# EAGLE design RN487 dev board (EAGLE 9.4.2)
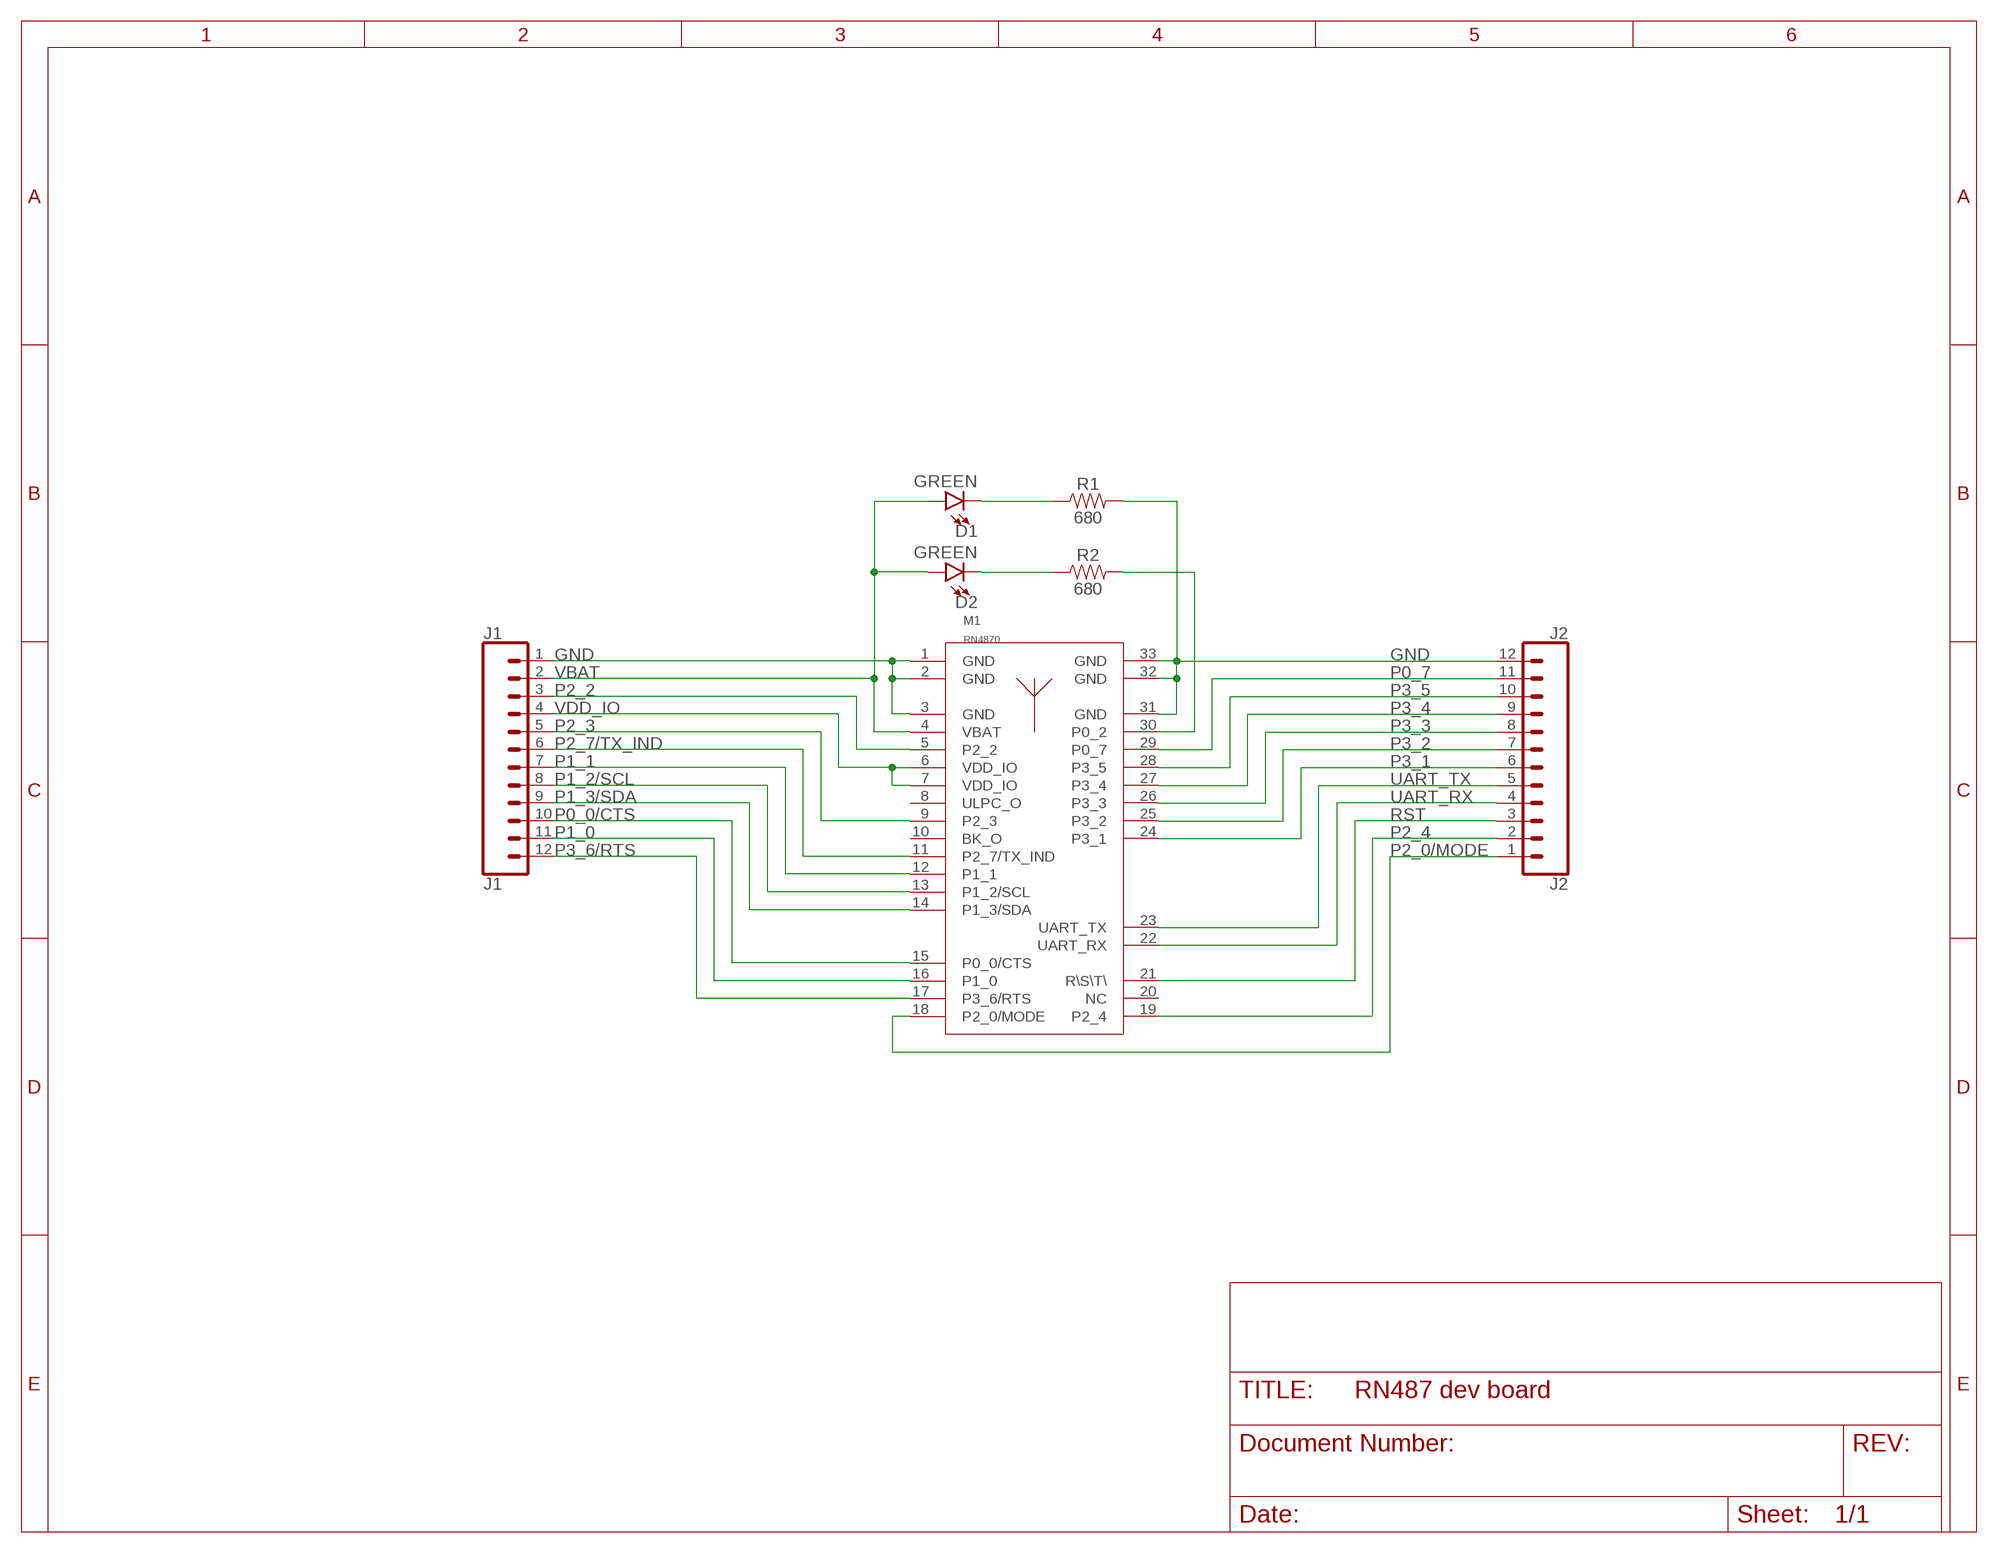
[diagram p0: schematic, sheet 1]

## Parts
D1  GREEN  LED-GREEN0603  [LED-0603]
D2  GREEN  LED-GREEN0603  [LED-0603]
J1  J1  CONN_12  [1X12]
J2  J2  CONN_12  [1X12]
M1  RN4870  [RN4870]
R1  680  680OHM-0603-1/10W-5%  [0603]
R2  680  680OHM-0603-1/10W-5%  [0603]

## Nets
GND: J1.1 J2.12 M1.1(GND) M1.2(GND) M1.3(GND) M1.31(GND) M1.32(GND) M1.33(GND) R1.2
N$1: D2.C R2.1
N$3: D1.C R1.1
N$17: M1.30(P0_2) R2.2
P0_0/CTS: J1.10 M1.15(P0_0/CTS)
P0_7: J2.11 M1.29(P0_7)
P1_0: J1.11 M1.16(P1_0)
P1_1: J1.7 M1.12(P1_1)
P1_2/SCL: J1.8 M1.13(P1_2/SCL)
P1_3/SDA: J1.9 M1.14(P1_3/SDA)
P2_0/MODE: J2.1 M1.18(P2_0/MODE)
P2_2: J1.3 M1.5(P2_2)
P2_3: J1.5 M1.9(P2_3)
P2_4: J2.2 M1.19(P2_4)
P2_7/TX_IND: J1.6 M1.11(P2_7/TX_IND)
P3_1: J2.6 M1.24(P3_1)
P3_2: J2.7 M1.25(P3_2)
P3_3: J2.8 M1.26(P3_3)
P3_4: J2.9 M1.27(P3_4)
P3_5: J2.10 M1.28(P3_5)
P3_6/RTS: J1.12 M1.17(P3_6/RTS)
RST: J2.3 M1.21(R\S\T\)
UART_RX: J2.4 M1.22(UART_RX)
UART_TX: J2.5 M1.23(UART_TX)
VBAT: D1.A D2.A J1.2 M1.4(VBAT)
VDD_IO: J1.4 M1.6(VDD_IO) M1.7(VDD_IO)
Unconnected: M1.8(ULPC_O) M1.10(BK_O) M1.20(NC)

## Library data of the parts
D1 D2 = SparkFun-LED:LED-GREEN: Green SMD LED Used in manufacturing of various products at SparkFun Packages: 0603 - SMD 0603 package [Product Link] <http://www.futureelectronics.com/en/technologies/semiconductors/optoelectronics/leds/Pages/9894312-LTST-C190GKT.aspx?CrossPart=HSMG-C190&IM=0> LilyPad 1206 - SMD1206 LilyPad package [Product Link] <http://www.futureelectronics.com/en/Technologies/Product.aspx?ProductID=IN150NGHARVATEKCORPORATION2049943&IM=0> 1206 - SMD1206 package [Product Link] <http://www.futureelectronics.com/en/technologies/semiconductors/optoelectronics/leds/Pages/8315665-LTST-C150KGKT.aspx?IM=0> 1206 Bottom Mount -SMD 1206 Bottom Mount [Product Link] <http://www.digikey.com/product-detail/en/lite-on-inc/LTST-C230KGKT/160-1456-1-ND/386854> SparkFun Products: Pro Mini 328 -5V <https://www.sparkfun.com/products/821> RedBoard <https://www.sparkfun.com/products/12757> MP3 Trigger <https://www.sparkfun.com/products/13720> Makey Makey <https://www.sparkfun.com/products/11076>; PROD_ID: DIO-00821
J1 J2 = SparkFun-Connectors:CONN_12: Multi connection point. Often used as Generic Header-pin footprint for 0.1 inch spaced/style header connections On any of the 0.1 inch spaced packages, you can populate with these: Break Away Headers - Straight <https://www.sparkfun.com/products/116> (PRT-00116) Break Away Male Headers - Right Angle <https://www.sparkfun.com/products/553> (PRT-00553) Female Headers <https://www.sparkfun.com/products/115> (PRT-00115) Break Away Headers - Machine Pin <https://www.sparkfun.com/products/117> (PRT-00117) Break Away Female Headers - Swiss Machine Pin <https://www.sparkfun.com/products/743> (PRT-00743) For SCREWTERMINALS and SPRING TERMINALS visit here: Screw Terimnals on SparkFun.com <https://www.sparkfun.com/search/results?term=Screw+Terminals> (5mm/3.5mm/2.54mm spacing) This device is also useful as a general connection point to wire up your design to another part of your project. Our various solder wires solder well into these plated through hole pads. Hook-Up Wire - Assortment (Stranded, 22 AWG) <https://www.sparkfun.com/products/11375> (PRT-11375) Hook-Up Wire - Assortment (Solid Core, 22 AWG) <https://www.sparkfun.com/products/11367> (PRT-11367) View the entire wire category on our website here <https://www.sparkfun.com/categories/141> Special notes: Molex polarized connector foot print use with SKU : PRT-08231 with associated crimp pins and housings. 1MM SMD Version SKU: PRT-10208 NOTES ON THE VARIANTS LOCK and LOCK_LONGPADS... This footprint was designed to help hold the alignment of a through-hole component (i.e. 6-pin header) while soldering it into place. You may notice that each hole has been shifted either up or down by 0.005 of an inch from it's more standard position (which is a perfectly straight line). This slight alteration caused the pins (the squares in the middle) to touch the edges of the holes. Because they are alternating, it causes a "brace" to hold the component in place. 0.005 has proven to be the perfect amount of "off-center" position when using our standard breakaway headers. Although looks a little odd when you look at the bare footprint, once you have a header in there, the alteration is very hard to notice. Also,if you push a header all the way into place, it is covered up entirely on the bottom side.
M1 = RN4870:RN4870
R1 R2 = SparkFun-Resistors:680OHM: 680Ω resistor A resistor is a passive two-terminal electrical component that implements electrical resistance as a circuit element. Resistors act to reduce current flow, and, at the same time, act to lower voltage levels within circuits. - Wikipedia; PROD_ID: RES-09333

## Board
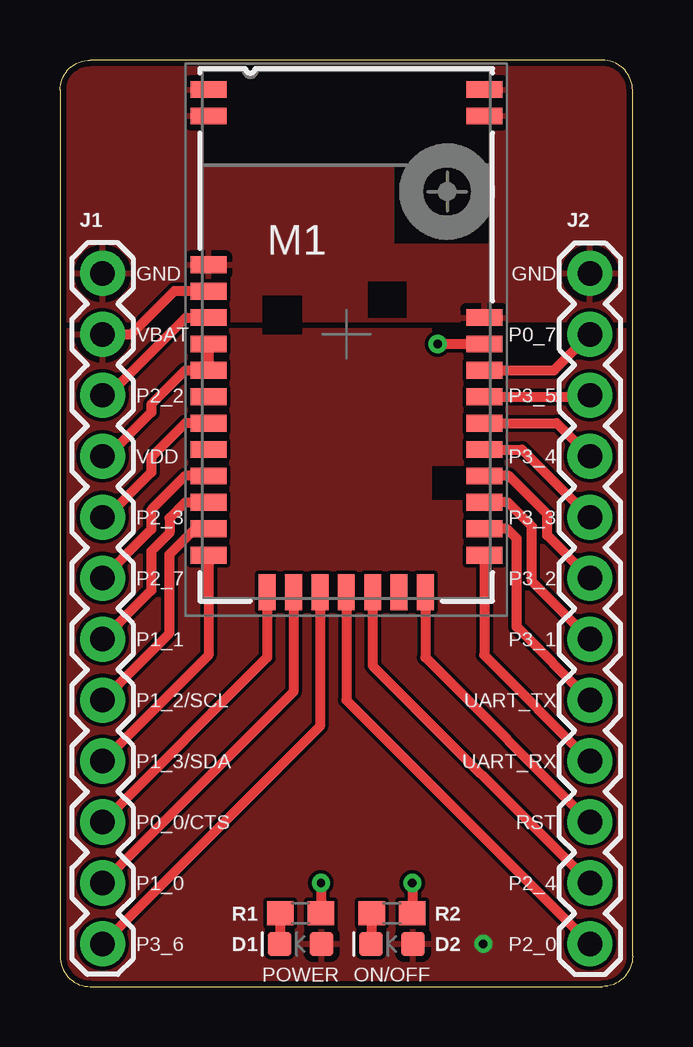
[diagram p1: board, top side]
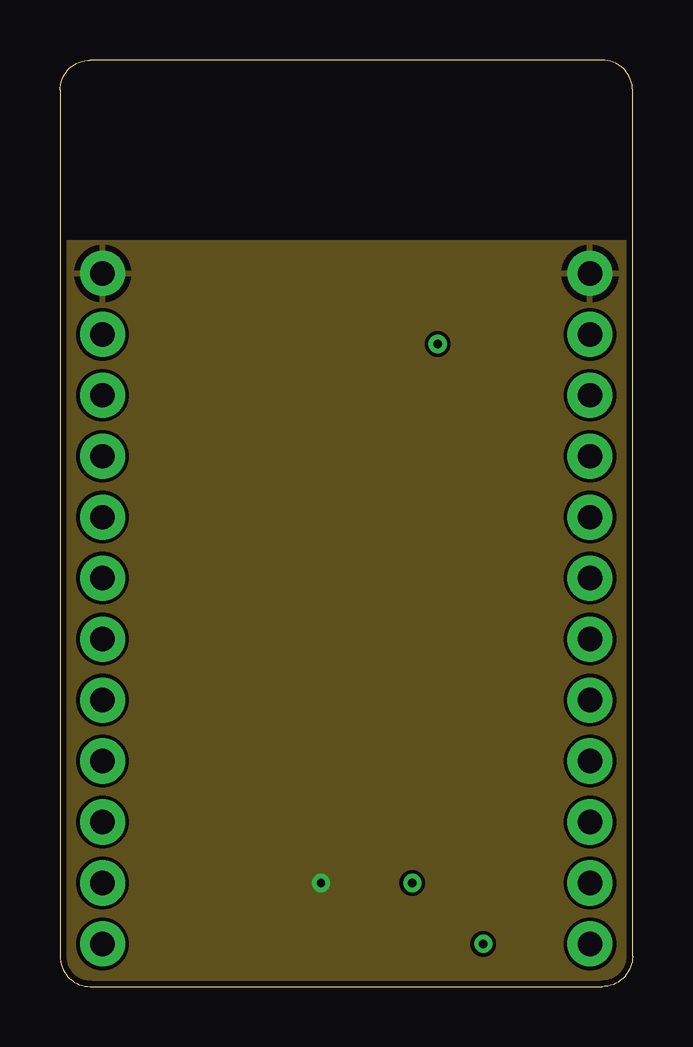
[diagram p2: board, inner layer Route2]
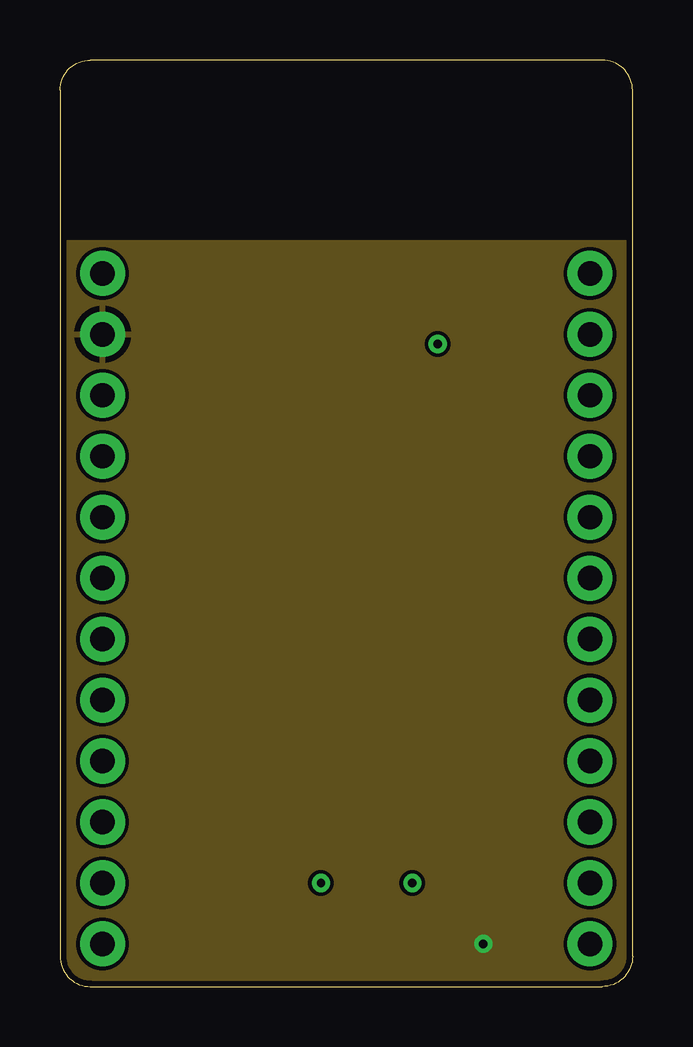
[diagram p3: board, inner layer Route15]
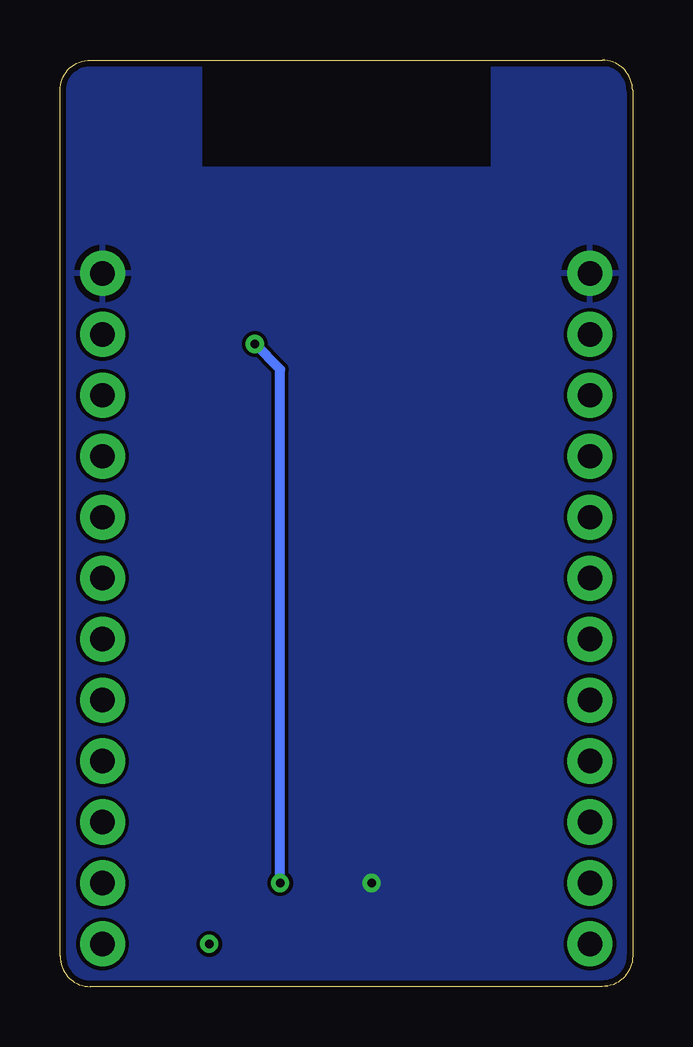
[diagram p4: board, bottom side, seen from below]

Size 23.88 x 38.61 mm. Coordinates in mm from the lower left corner, seen from the top.
Outline: 1.27,0 22.61,0 arc90 23.88,1.27 23.88,37.34 arc90 22.61,38.61 1.27,38.61 arc90 0,37.34 0,1.27 arc90 1.27,0
Copper layers (1+2*15+16): Top 0.0178mm / dielectric 12mil / Route2 0.0356mm / dielectric 28mil / Route15 0.0356mm / dielectric 12mil / Bottom 0.0178mm
Design rules "SSC-EAGLE-4Lyr_v1.0.0.3 *": minimum track width 6mil, minimum drill 8mil, track to track 6mil, track to pad 6mil, pad to pad 6mil, via to via 6mil, smd to smd 6mil, copper to edge 10mil, drill to drill 16mil, minimum pad ring 8mil, minimum via ring 8mil, stop-mask expansion 3mil, vias tented up to drill 0mil, thermal gap 10mil

### Footprints (pad centres in the part's own frame; a part is rotated, then mirrored left to right if it is on the bottom)
LED-0603 = smd 1 x 1: A -0.877,0; C 0.877,0
1X12 = drill 1.016 pad 1.88: 1 0,0; 2 2.54,0; 3 5.08,0; 4 7.62,0; 5 10.16,0; 6 12.7,0; 7 15.24,0; 8 17.78,0; 9 20.32,0; 10 22.86,0; 11 25.4,0; 12 27.94,0
RN4870 = smd 1.5 x 0.7: 1 -5.742,10.2; 2 -5.742,9.1; 3 -5.75,2.9; 4 -5.75,1.8; 5 -5.75,0.7; 6 -5.75,-0.4; 7 -5.75,-1.5; 8 -5.75,-2.6; 9 -5.75,-3.7; 10 -5.75,-4.8; 11 -5.75,-5.9; 12 -5.75,-7; 13 -5.75,-8.1; 14 -5.75,-9.2; 22 5.75,-9.2; 23 5.75,-8.1; 24 5.75,-7; 25 5.75,-5.9; 26 5.75,-4.8; 27 5.75,-3.7; 28 5.75,-2.6; 29 5.75,-1.5; 30 5.75,-0.4; 31 5.75,0.7; 32 5.75,9.1; 33 5.75,10.2 | smd 0.7 x 1.5: 15 -3.3,-10.75; 16 -2.2,-10.75; 17 -1.1,-10.75; 18 0,-10.75; 19 1.1,-10.75; 20 2.2,-10.75; 21 3.3,-10.75
0603 = smd 1.1 x 1: 1 -0.85,0; 2 0.85,0

### Placement (x,y rotation side)
D1  10.03,1.78 180 top
D2  13.84,1.78 180 top
J1  1.78,29.72 270 top
J2  22.1,1.78 90 top
M1  11.94,27.18 0 top
R1  10.03,3.05 0 top
R2  13.84,3.05 0 top

### Tracks (layer width: path | path; a pad name or v marks a point on that pad's centre or on a via)
GND  (via drill 0.35)
  Top 0.406: v10.88,4.32 R1.2
  pour Top: 0,27.81 23.88,27.81 23.88,38.61 0,38.61
  pour Bottom: 0,0 23.88,0 23.88,38.61 0,38.61
  pour Route2: 0,0 0,30.99 23.88,30.99 23.88,0
N$1
  Top 0.406: R2.1 12.99,1.8 D2.C
N$3
  Top 0.406: R1.1 9.18,1.8 D1.C
N$17  (via drill 0.35)
  Top 0.406: v14.69,4.32 R2.2 | v15.75,26.78 M1.30
  Bottom 0.406: v14.69,4.32 14.69,25.72 v15.75,26.78
P0_0/CTS
  Top 0.406: M1.15 8.64,13.72 J1.10
P0_7
  Top 0.406: M1.29 20.6,25.68 J2.11
P1_0
  Top 0.406: J1.11 9.74,12.28 M1.16
P1_1
  Top 0.406: J1.7 3.81,16.51 3.81,18.14 4.57,18.9 4.57,19.52 5.23,20.18 M1.12
P1_2/SCL
  Top 0.406: J1.8 4.57,14.73 4.57,18.01 5.64,19.08 M1.13
P1_3/SDA
  Top 0.406: M1.14 6.19,13.81 J1.9
P2_0/MODE
  Top 0.406: M1.18 11.94,11.94 J2.1
P2_2
  Top 0.406: J1.3 2,24.64 5.24,27.88 M1.5
P2_3
  Top 0.406: M1.9 5.23,23.48 3.81,22.06 3.81,21.43 1.94,19.56 J1.5
P2_4
  Top 0.406: M1.19 13.04,13.38 J2.2
P2_7/TX_IND
  Top 0.406: M1.11 5.22,21.28 3.81,19.86 3.81,19.05 J1.6
P3_1
  Top 0.406: J2.6 19.68,16.89 19.68,19.18 18.68,20.18 M1.24
P3_2
  Top 0.406: J2.7 20.32,18.8 20.32,19.68 18.73,21.28 M1.25
P3_3
  Top 0.406: M1.26 19.28,22.38 J2.8
P3_4
  Top 0.406: M1.27 20.72,23.48 J2.9
P3_5
  Top 0.406: M1.28 22.04,24.58 J2.10
P3_6/RTS
  Top 0.406: M1.17 10.84,10.84 J1.12
RST
  Top 0.406: J2.3 15.24,13.72 M1.21
UART_RX
  Top 0.406: M1.22 17.69,13.81 J2.4
UART_TX
  Top 0.406: M1.23 17.93,19.07 18.64,19.07 19.05,18.67 19.05,14.99 J2.5
VBAT  (via drill 0.35)
  Top 0.406: M1.4 4.77,28.98 2.97,27.18 J1.2
  other vias: 17.65,1.78
  pour Top: 0,27.3 0,0 23.88,0 23.88,27.3
  pour Route15: 0,0 0,30.99 23.88,30.99 23.88,0
VDD_IO
  Top 0.406: J1.4 1.98,22.1 3.81,23.93 3.81,24.26 5.23,25.68 M1.7 M1.6

### Text on the board
tNames: GND | GND | VBAT | P0_7 | P2_2 | P3_5 | VDD | P3_4 | P2_3 | P3_3 | P2_7 | P3_2 | P1_1 | P3_1 | P1_2/SCL | UART_TX | P1_3/SDA | UART_RX | P0_0/CTS | RST | P1_0 | P2_4 | P3_6 | P2_0 | POWER | ON/OFF